# Altium schematic sheet Power stage.SchDoc (part 1 of 3)
size A4; DrawnBy: Mohamed Drissi; SheetNumber: 2; SheetTotal: 8
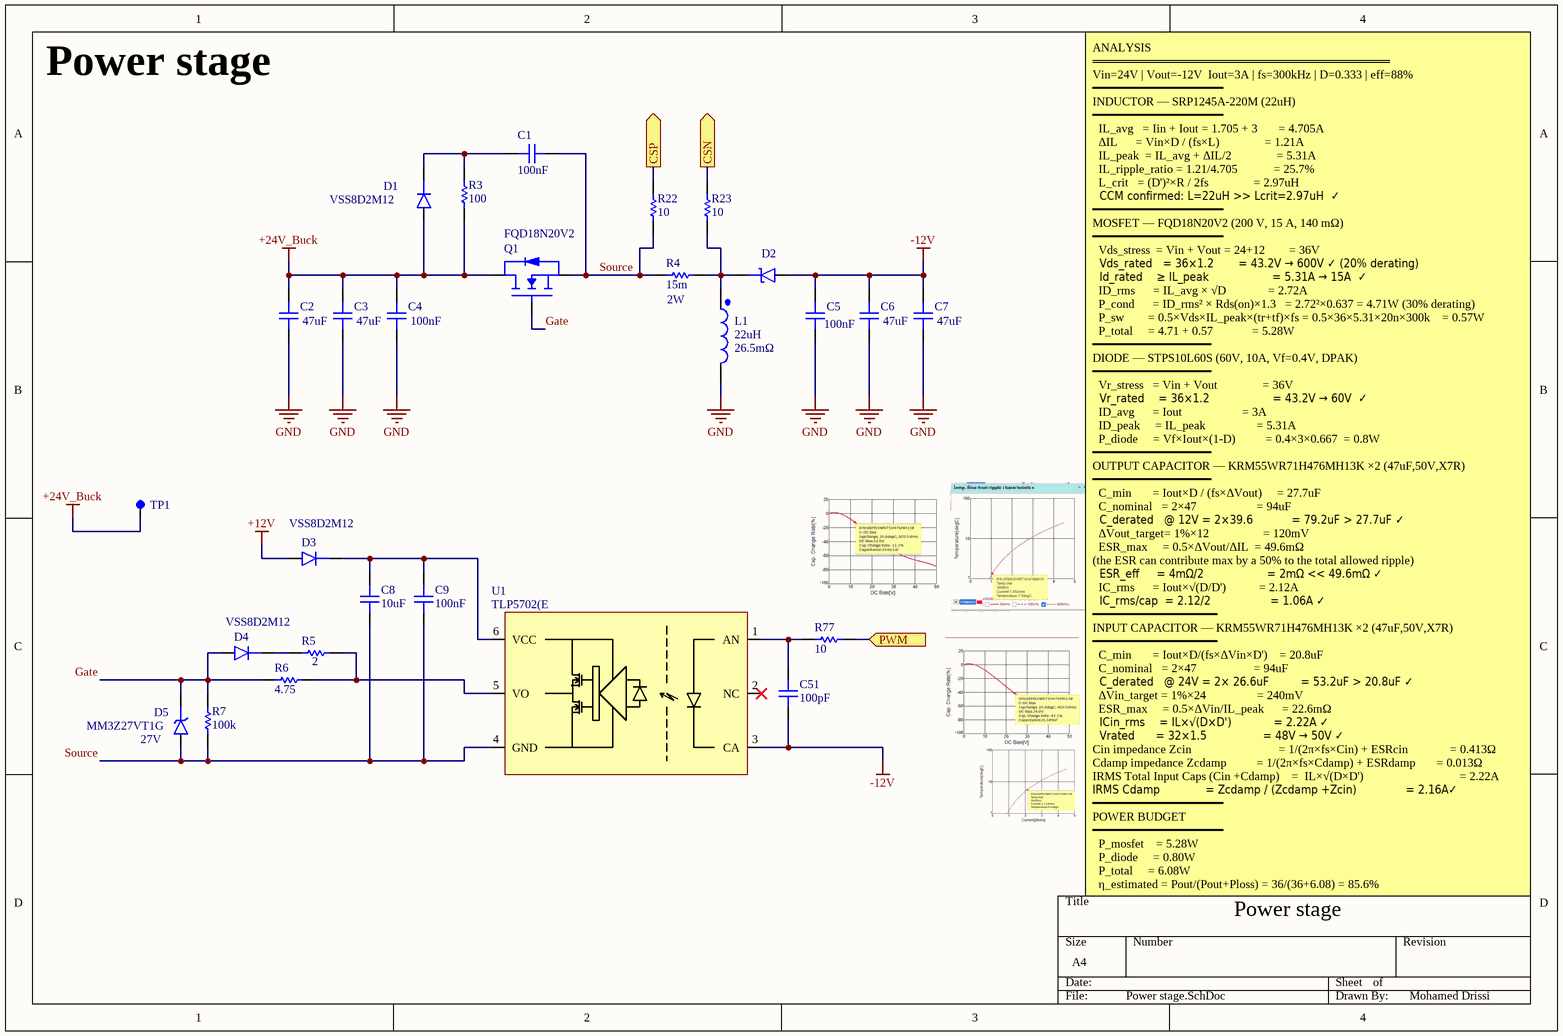
[diagram p0: Power stage.SchDoc]

## Parts
C1  Capacitance: 100nF  [cap_0603]  (hidden comment: GMC10X7R104K100NT)
C2  Capacitance: 47uF  [cap_2220]  (hidden comment: KRM55WR71H476MH13K)
C3  Capacitance: 47uF  [cap_2220]  (hidden comment: KRM55WR71H476MH13K)
C4  Capacitance: 100nF  [cap_0603]  (hidden comment: GMC10X7R104K100NT)
C5  Capacitance: 100nF  [cap_0603]  (hidden comment: GMC10X7R104K100NT)
C6  Capacitance: 47uF  [cap_2220]  (hidden comment: KRM55WR71H476MH13K)
C7  Capacitance: 47uF  [cap_2220]  (hidden comment: KRM55WR71H476MH13K)
C8  Capacitance: 10uF  [cap_1210]  (hidden comment: 885012209073)
C9  Capacitance: 100nF  [cap_0603]  (hidden comment: GMC10X7R104K100NT)
C51  Capacitance: 100pF  [Cap_0603]  (hidden comment: GCM1885C2A101JA16D)
D1  VSS8D2M12  [DO-221AD]
D2  STPS10L60D  [TO-220]  (value not drawn)
D3  VSS8D2M12  [DO-221AD]
D4  VSS8D2M12  [DO-221AD]
D5  MM3Z27VT1G  Reference Voltage: 27V  [SOD-323]
L1  DC Resistance (DCR): 26.5mΩ  Inductance: 22uH  [MWLA1707S]  (hidden comment: MWLA1707S-220MT)
Q1  FQD18N20V2  [TO-252  (DPAK)]
R3  Resistance: 100  [res_2512]  (hidden comment: CPA2512E1000FS-T10)
R4  Resistance: 15m  Power: 2W  [res_2512]  (hidden comment: D1MPAB2512QR015FA-T4)
R5  value 2  [res_0603]  (hidden comment: CRCW06032R00FKEA)
R6  value 4.75  [res_0603]  (hidden comment: CRCW06034R75FKEAHP)
R7  Resistance: 100k  [res_0603]  (hidden comment: CRCW0603100KFKEA)
R22  Resistance: 10  [res_0603]  (hidden comment: RC0603FR-0710RL)
R23  Resistance: 10  [res_0603]  (hidden comment: RC0603FR-0710RL)
R77  Resisitance: 10  [res_0603]  (hidden comment: RT0603BRE0710RL)
TP1  5000  [TH TP]  (value not drawn)
U1  TLP5702(E  [TOSHIBA: 11-4N1A]

## Ports
CSN (out, see Main[3B], current sense[2B]), CSP (out, see Main[3B], current sense[2B]), PWM (in, see Main[3B], Control circuit[4B])

## Nets
+12V: D3.A
+24V_Buck: C2.2 C3.2 C4.2 D1.A Q1.2(D) R3.1 TP1.1
-12V: C5.2 C6.2 C7.2 C51.1 D2.2(A) U1.3(CA)
GND: C2.1 C3.1 C4.1 C5.1 C6.1 C7.1 L1.2
CSN: R23.2 ; port CSN
CSP: R22.2 ; port CSP
Gate: D4.A D5.k(C) Q1.1(G) R6.1 R7.2
PWM: R77.2 ; port PWM
Source: C1.1 C8.1 C9.1 D5.A Q1.3(S) R4.1 R7.1 R22.1 U1.4(GND)
NetC1_2: C1.2 D1.C R3.2
NetC8_2: C8.2 C9.2 D3.C U1.6(VCC)
NetC51_2: C51.2 R77.1 U1.1(AN)
NetD2_1: D2.1(K) L1.1 R4.2 R23.1
NetD4_C: D4.C R5.1
NetR5_2: R5.2 R6.2 U1.5(VO)

Not connected (* = marked no-connect by the designer): U1 2(NC)*

## Notes on the sheet
- Power stage
- ANALYSIS
  ═══════════════════════════════════
  Vin=24V | Vout=-12V  Iout=3A | fs=300kHz | D=0.333 | eff=88%
  ━━━━━━━━━━━━━━━━━━━━━━
  INDUCTOR — SRP1245A-220M (22uH)
  ━━━━━━━━━━━━━━━━━━━━━━
  IL_avg   = Iin + Iout = 1.705 + 3       = 4.705A
  ΔIL      = Vin×D / (fs×L)               = 1.21A
  IL_peak  = IL_avg + ΔIL/2               = 5.31A
  IL_ripple_ratio = 1.21/4.705            = 25.7%
  L_crit   = (D')²×R / 2fs               = 2.97uH
  CCM confirmed: L=22uH >> Lcrit=2.97uH  ✓
  ━━━━━━━━━━━━━━━━━━━━━━
  MOSFET — FQD18N20V2 (200 V, 15 A, 140 mΩ)
  ━━━━━━━━━━━━━━━━━━━━━━
  Vds_stress  = Vin + Vout = 24+12        = 36V
  Vds_rated   = 36×1.2       = 43.2V → 600V ✓ (20% derating)
  Id_rated    ≥ IL_peak                  = 5.31A → 15A  ✓
  ID_rms      = IL_avg × √D              = 2.72A
  P_cond      = ID_rms² × Rds(on)×1.3   = 2.72²×0.637 = 4.71W (30% derating)
  P_sw        = 0.5×Vds×IL_peak×(tr+tf)×fs = 0.5×36×5.31×20n×300k    = 0.57W
  P_total     = 4.71 + 0.57             = 5.28W
  ━━━━━━━━━━━━━━━━━━━━
  DIODE — STPS10L60S (60V, 10A, Vf=0.4V, DPAK)
  ━━━━━━━━━━━━━━━━━━━━
  Vr_stress   = Vin + Vout               = 36V
  Vr_rated    = 36×1.2                  = 43.2V → 60V  ✓
  ID_avg      = Iout                    = 3A
  ID_peak     = IL_peak                 = 5.31A
  P_diode     = Vf×Iout×(1-D)          = 0.4×3×0.667  = 0.8W
  ━━━━━━━━━━━━━━━━━━━━
  OUTPUT CAPACITOR — KRM55WR71H476MH13K ×2 (47uF,50V,X7R)
  ━━━━━━━━━━━━━━━━━━━━
  C_min       = Iout×D / (fs×ΔVout)     = 27.7uF
  C_nominal   = 2×47                    = 94uF
  C_derated   @ 12V = 2×39.6           = 79.2uF > 27.7uF ✓
  ΔVout_target= 1%×12                  = 120mV
  ESR_max     = 0.5×ΔVout/ΔIL  = 49.6mΩ
  (the ESR can contribute max by a 50% to the total allowed ripple)
  ESR_eff     = 4mΩ/2                  = 2mΩ << 49.6mΩ ✓
  IC_rms      = Iout×√(D/D')           = 2.12A
  IC_rms/cap  = 2.12/2                 = 1.06A ✓
  ━━━━━━━━━━━━━━━━━━━━━
  INPUT CAPACITOR — KRM55WR71H476MH13K ×2 (47uF,50V,X7R)
  ━━━━━━━━━━━━━━━━━━━━━
  C_min       = Iout×D/(fs×ΔVin×D')    = 20.8uF
  C_nominal   = 2×47                   = 94uF
  C_derated   @ 24V = 2× 26.6uF         = 53.2uF > 20.8uF ✓
  ΔVin_target = 1%×24                 = 240mV
  ESR_max     = 0.5×ΔVin/IL_peak      = 22.6mΩ
  ICin_rms    = IL×√(D×D')            = 2.22A ✓
  Vrated      = 32×1.5                = 48V → 50V ✓
  Cin impedance Zcin	                            = 1/(2π×fs×Cin) + ESRcin              = 0.413Ω
  Cdamp impedance Zcdamp	         = 1/(2π×fs×Cdamp) + ESRdamp       = 0.013Ω
  IRMS Total Input Caps (Cin +Cdamp)    =  IL×√(D×D')                                = 2.22A
  IRMS Cdamp 		          = Zcdamp / (Zcdamp +Zcin)              = 2.16A✓
  ━━━━━━━━━━━━━━━━━━━━━━
  POWER BUDGET
  ━━━━━━━━━━━━━━━━━━━━━━
  P_mosfet    = 5.28W
  P_diode     = 0.80W
  P_total     = 6.08W
  η_estimated = Pout/(Pout+Ploss) = 36/(36+6.08) = 85.6%